# EAGLE design MAC.PHY_shield_boardrouter (EAGLE 6.2)
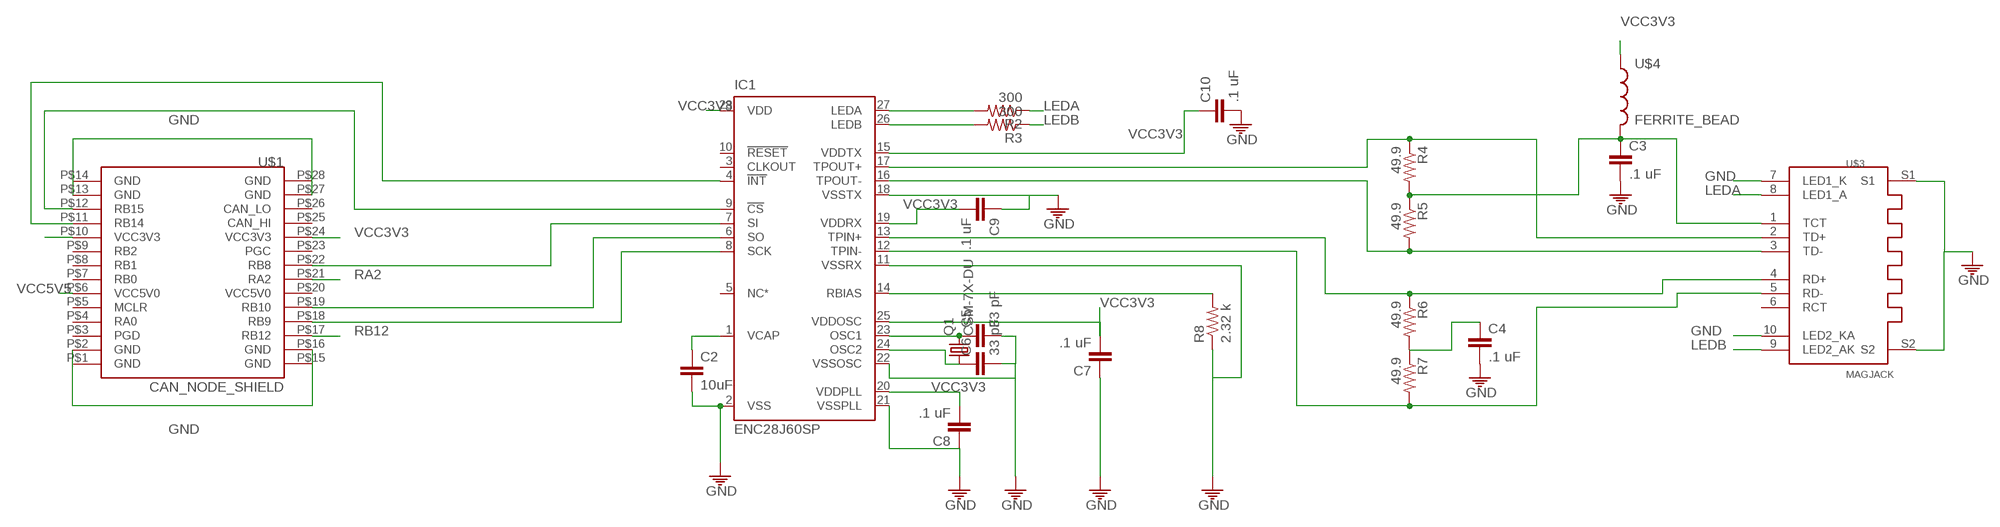
[diagram p0: schematic, sheet 1]

## Parts
C2  10uF  CAP1206  [1206]
C3  .1 uF  CAP1206  [1206]
C4  .1 uF  CAP1206  [1206]
C5  33 pF  CAP1206  [1206]
C6  33 pF  CAP1206  [1206]
C7  .1 uF  CAP1206  [1206]
C8  .1 uF  CAP1206  [1206]
C9  .1 uF  CAP1206  [1206]
C10  .1 uF  CAP1206  [1206]
IC1  ENC28J60SP  [DIL28-3]
Q1  CSM-7X-DU  [CSM-7X-DU]
R2  300  RESISTOR0805-RES  [0805]
R3  300  RESISTOR0805-RES  [0805]
R4  49.9  RESISTOR0805-RES  [0805]
R5  49.9  RESISTOR0805-RES  [0805]
R6  49.9  RESISTOR0805-RES  [0805]
R7  49.9  RESISTOR0805-RES  [0805]
R8  2.32 k  RESISTOR0805-RES  [0805]
U$1  CAN_NODE_SHIELD  [CAN_NODE_SHIELD]
U$3  MAGJACK  [08B0-1X1T-06-F]
U$4  FERRITE_BEAD  [1206]

## Nets
GND: C2.2 C3.2 C4.2 C5.2 C6.2 C7.1 C8.1 C9.1 C10.2 IC1.2(VSS) IC1.11(VSSRX) IC1.18(VSSTX) IC1.21(VSSPLL) IC1.22(VSSOSC) R8.1 U$1.P$1(GND) U$1.P$2(GND) U$1.P$13(GND) U$1.P$14(GND) U$1.P$15(GND) U$1.P$16(GND) U$1.P$27(GND) U$1.P$28(GND) U$3.7(LED1_K) U$3.10(LED2_KA) U$3.S1 U$3.S2
LEDA: R2.1 U$3.8(LED1_A)
LEDB: R3.1 U$3.9(LED2_AK)
N$1: C2.1 IC1.1(VCAP)
N$2: IC1.27(LEDA) R2.2
N$3: IC1.26(LEDB) R3.2
N$4: C3.1 R4.2 R5.1 U$3.1(TCT) U$4.2
N$5: IC1.17(TPOUT+) R4.1 U$3.2(TD+)
N$6: IC1.16(TPOUT-) R5.2 U$3.3(TD-)
N$7: IC1.13(TPIN+) R6.1 U$3.4(RD+)
N$8: C4.1 R6.2 R7.1
N$9: IC1.12(TPIN-) R7.2 U$3.5(RD-)
N$10: IC1.9(!CS) U$1.P$12(RB15)
N$11: IC1.14(RBIAS) R8.2
N$12: IC1.8(SCK) U$1.P$18(RB9)
N$13: C5.1 IC1.23(OSC1) Q1.2
N$14: C6.1 IC1.24(OSC2) Q1.1
N$15: IC1.6(SO) U$1.P$19(RB10)
N$16: IC1.7(SI) U$1.P$22(RB8)
N$17: IC1.4(!INT) U$1.P$11(RB14)
RA2: U$1.P$21(RA2)
RB12: U$1.P$17(RB12)
VCC3V3: C7.2 C8.2 C9.2 C10.1 IC1.15(VDDTX) IC1.19(VDDRX) IC1.20(VDDPLL) IC1.25(VDDOSC) IC1.28(VDD) U$1.P$10(VCC3V3) U$1.P$24(VCC3V3) U$4.1
VCC5V5: U$1.P$6(VCC5V0)
Unconnected: IC1.3(CLKOUT) IC1.5(NC*) IC1.10(!RESET) U$1.P$3(PGD) U$1.P$4(RA0) U$1.P$5(MCLR) U$1.P$7(RB0) U$1.P$8(RB1) U$1.P$9(RB2) U$1.P$20(VCC5V0) U$1.P$23(PGC) U$1.P$25(CAN_HI) U$1.P$26(CAN_LO) U$3.6(RCT)

## Library data of the parts
C2-C10 = ASL:CAP: Capacitor Standard 0603 ceramic capacitor, and 0.1" leaded capacitor.
IC1 = ASL:ENC28J60: Stand-Alone Ethernet Controller with SPI Interface Source: http://ww1.microchip.com/downloads/en/DeviceDoc/39662c.pdf; MF: MICROCHIP; MPN: ENC28J60/SP; OC_FARNELL: 1084619; OC_NEWARK: 96K3661
Q1 = crystal:CSM-7X-DU: SMD CRYSTAL Source: www.ecsxtal.com .. Crystal 3.6864MHz CSM_7X_DU.PDF; OC_FARNELL: unknown; OC_NEWARK: unknown
R2-R8 = ASL:RESISTOR: Resistor Basic schematic elements and footprints for 0603, 1206, and PTH resistors.
U$1 = ASL:CAN_NODE_SHIELD: A shield part for the dsPIC33f CAN node.
U$3 = ASL:MAGJACK
U$4 = ASL:FERRITE_BEAD

## Board
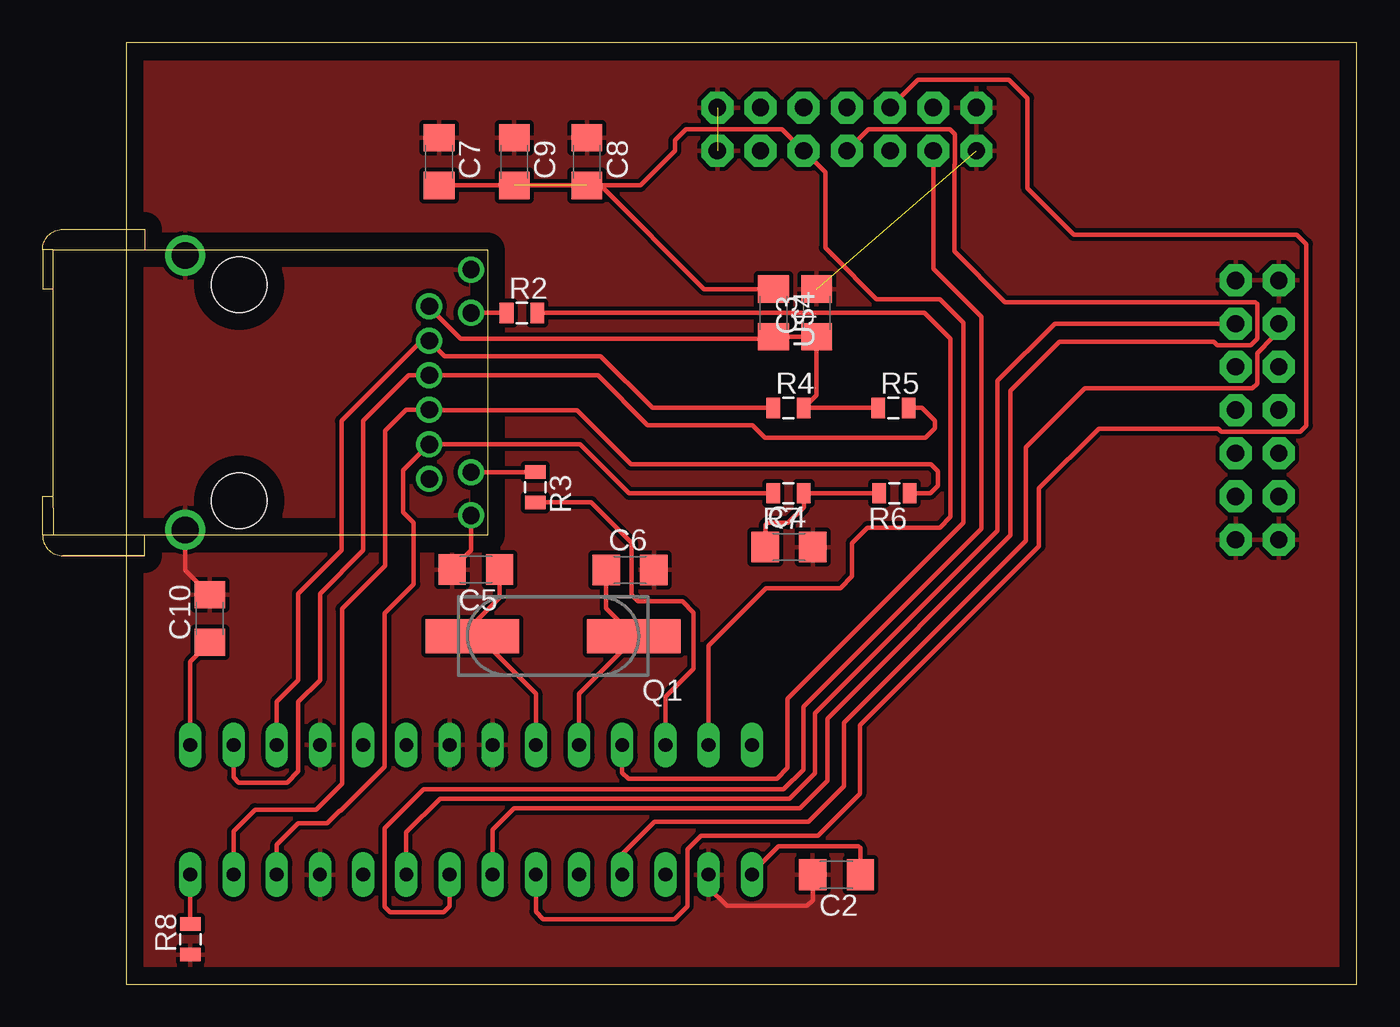
[diagram p1: board, top side]
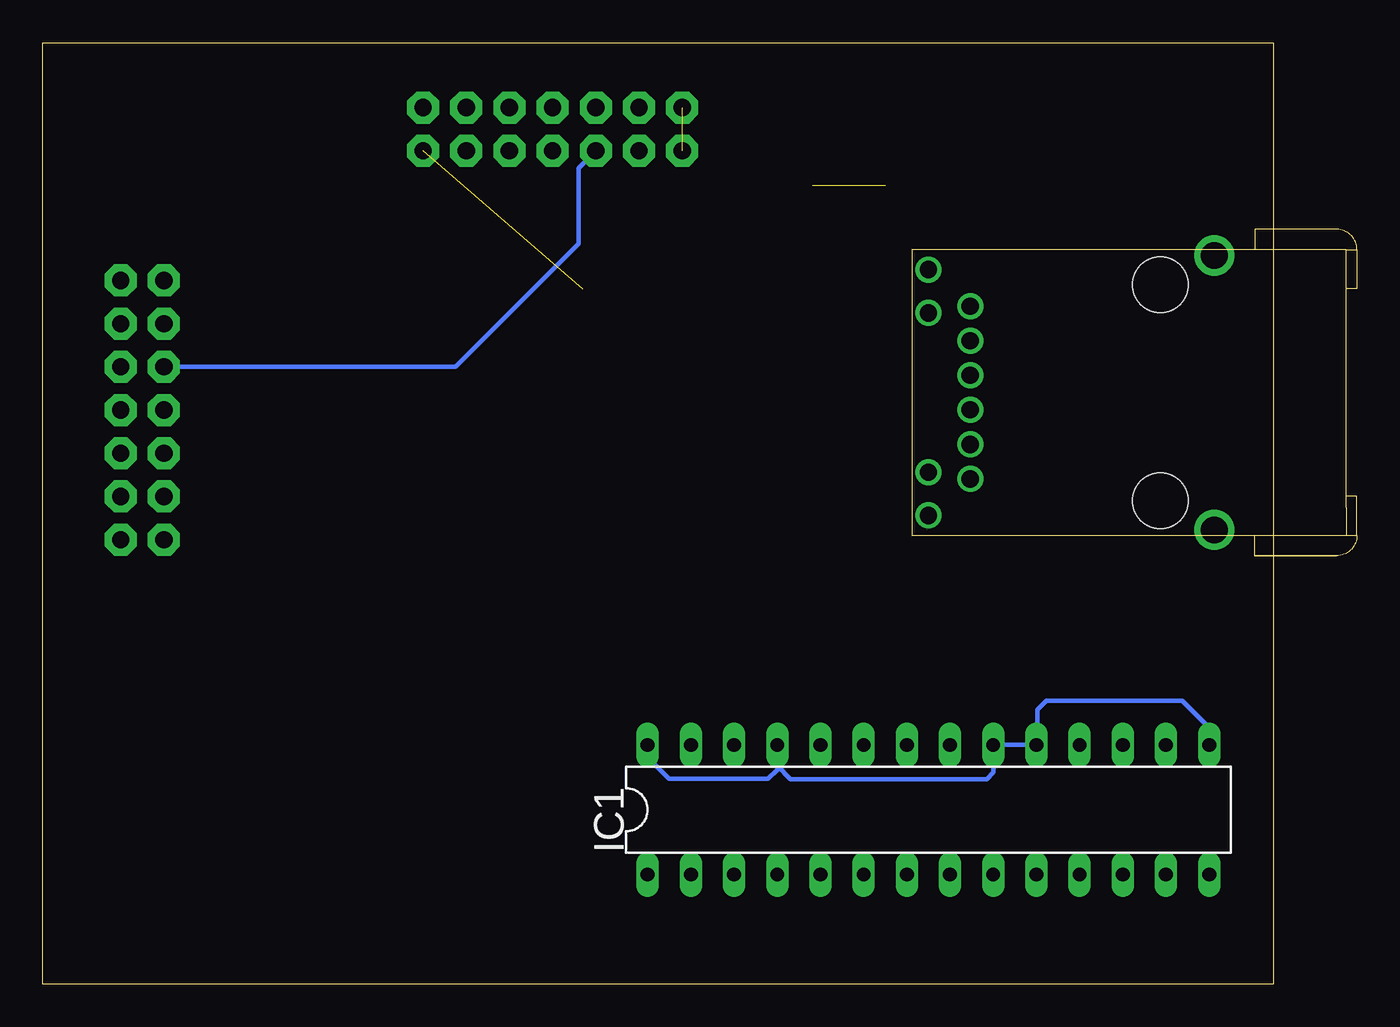
[diagram p2: board, bottom side, seen from below]

Size 72.36 x 55.36 mm. Coordinates in mm from the lower left corner, seen from the top.
Outline: 0,0 72.36,0 72.36,55.34 0,55.36 0,0
Copper layers (1*16): Top 0.035mm / dielectric 1.5mm / Bottom 0.035mm
Design rules: minimum track width 10mil, minimum drill 24mil, track to track 8mil, track to pad 8mil, pad to pad 8mil, via to via 8mil, smd to smd 8mil, copper to edge 40mil, drill to drill 8mil, minimum pad ring 10mil, minimum via ring 8mil, stop-mask expansion 4mil, vias tented up to drill 0mil, thermal gap 10mil

### Footprints (pad centres in the part's own frame; a part is rotated, then mirrored left to right if it is on the bottom)
1206 = smd 1.6 x 1.8: 1 -1.4,0; 2 1.4,0
DIL28-3 = drill 0.813 long: 1 -16.51,-3.81; 2 -13.97,-3.81; 3 -11.43,-3.81; 4 -8.89,-3.81; 5 -6.35,-3.81; 6 -3.81,-3.81; 7 -1.27,-3.81; 8 1.27,-3.81; 9 3.81,-3.81; 10 6.35,-3.81; 11 8.89,-3.81; 12 11.43,-3.81; 13 13.97,-3.81; 14 16.51,-3.81; 15 16.51,3.81; 16 13.97,3.81; 17 11.43,3.81; 18 8.89,3.81; 19 6.35,3.81; 20 3.81,3.81; 21 1.27,3.81; 22 -1.27,3.81; 23 -3.81,3.81; 24 -6.35,3.81; 25 -8.89,3.81; 26 -11.43,3.81; 27 -13.97,3.81; 28 -16.51,3.81
CSM-7X-DU = smd 5.5 x 2: 1 -4.75,0; 2 4.75,0
0805 = smd 0.8 x 1.2: 1 -0.9,0; 2 0.9,0
CAN_NODE_SHIELD = drill 1.016 pad 1.88 octagon: P$1 47.498,8.255; P$2 44.958,8.255; P$3 47.498,10.795; P$4 44.958,10.795; P$5 47.498,13.335; P$6 44.958,13.335; P$7 47.498,15.875; P$8 44.958,15.875; P$9 47.498,18.415; P$10 44.958,18.415; P$11 47.498,20.955; P$12 44.958,20.955; P$13 47.498,23.495; P$14 44.958,23.495; P$15 29.718,33.655; P$16 29.718,31.115; P$17 27.178,33.655; P$18 27.178,31.115; P$19 24.638,33.655; P$20 24.638,31.115; P$21 22.098,33.655; P$22 22.098,31.115; P$23 19.558,33.655; P$24 19.558,31.115; P$25 17.018,33.655; P$26 17.018,31.115; P$27 14.478,33.655; P$28 14.478,31.115
08B0-1X1T-06-F = drill 1.02: 1 2.15,2.46; 2 4.18,2.46; 3 6.21,2.46; 4 8.24,2.46; 5 10.27,2.46; 6 12.3,2.46; 7 0,0; 8 2.54,0; 9 11.91,0; 10 14.45,0 | drill 1.57: S1 -0.83,16.808; S2 15.3,16.809 | hole 3.25: 0.88,13.63; 13.58,13.63

### Placement (x,y rotation side)
C2  41.76,6.44 180 top
C3  40.59,39.47 90 top
C4  38.96,25.71 0 top
C5  20.55,24.38 180 top
C6  29.62,24.36 0 top
C7  18.39,48.36 270 top
C8  27.08,48.36 270 top
C9  22.81,48.36 270 top
C10  4.9,21.5 90 top
IC1  20.27,10.26 0 bottom
Q1  25.1,20.47 180 top
R2  23.25,39.47 0 top
R3  24.05,29.22 270 top
R4  38.94,33.88 0 top
R5  45.1,33.88 0 top
R6  45.16,28.87 180 top
R7  38.94,28.87 180 top
R8  3.76,2.64 90 top
U$1  20.27,17.88 0 top
U$3  20.27,42.01 270 bottom
U$4  38.05,39.47 270 top

### Tracks (layer width: path | path; a pad name or v marks a point on that pad's centre or on a via)
GND  (2 unrouted)
  Top 0.254: IC1.2 34.24,5.69 35.31,4.62 40.03,4.62 40.36,4.95 C2.2 | U$3.S2 3.46,24.34 C10.2 | U$3.10 20.27,25.5 C5.2
  pour Top (isolate 0.254): 71.02,54.58 0.51,54.58 0.51,0.58 71.53,0.58 71.53,54.58
LEDA
  Top 0.254: U$3.8 R2.1
LEDB
  Top 0.254: U$3.9 24.03,30.1 R3.1
N$1
  Top 0.254: IC1.1 36.78,6.55 38.35,8.13 43.05,8.13 43.15,8.03 C2.1
N$2
  Top 0.254: R2.2 46.94,39.47 48.46,37.95 48.46,27.48 47.83,26.85 43.59,26.85 42.67,25.93 42.67,23.98 41.99,23.29 37.62,23.29 34.24,19.91 IC1.27
N$3
  Top 0.254: R3.2 27.33,28.32 29.69,25.96 29.69,22.91 30.1,22.5 32.69,22.5 33.35,21.84 33.35,18.54 31.7,16.89 IC1.26
N$4
  Top 0.254: R5.1 R4.2 40.59,34.63 C3.1 U$4.2 37.92,37.95 19.66,37.95 17.81,39.8 U$3.1
N$5
  Top 0.254: IC1.17 8.84,16.61 10.11,17.88 10.11,22.96 12.65,25.5 12.65,33.12 17.36,37.83 U$3.2 18.71,36.93 27.89,36.93 30.94,33.88 R4.1
N$6
  Top 0.254: R5.2 46.79,33.88 47.55,33.12 47.55,32.69 46.99,32.13 37.54,32.13 36.8,32.87 30.66,32.87 27.74,35.79 17.82,35.79 U$3.3 16.6,35.8 13.92,33.12 13.92,25.5 11.38,22.96 11.38,17.88 10.11,16.61 10.11,12.52 9.45,11.86 6.6,11.86 6.3,12.17 IC1.16
N$7
  Top 0.254: R6.1 47.28,28.87 47.73,29.31 47.73,30.15 47.29,30.58 29.67,30.58 26.49,33.76 17.82,33.76 U$3.4 16.45,33.77 15.21,32.54 15.21,24.61 12.67,22.07 12.67,11.79 11.15,10.26 7.57,10.26 6.3,8.99 IC1.13
N$8
  Top 0.254: R6.2 R7.1 39.84,28.05 38.91,27.13 37.69,27.13 37.57,27 C4.1
N$9
  Top 0.254: R7.2 38.02,28.86 29.57,28.86 26.68,31.74 U$3.5 16.28,30.21 16.28,27.74 16.89,27.13 16.89,23.52 15.19,21.82 15.19,12.8 12.6,10.21 12.55,10.21 11.81,9.47 10.11,9.47 8.84,8.21 IC1.12
N$10
  Top 0.254: IC1.9 16.46,8.94 18.44,10.92 38.99,10.92 40.49,12.42 40.49,15.93 51.23,26.67 51.23,35.48 54.58,38.84 U$1.P$12
N$11
  Top 0.254: IC1.14 R8.2
N$12
  Top 0.254: U$1.P$18 47.45,42.06 50.27,39.24 50.27,26.77 39.8,16.31 39.8,12.62 38.63,11.46 17.48,11.46 15.19,9.17 15.19,4.55 15.49,4.24 18.64,4.24 19,4.6 IC1.8
N$13
  Top 0.254: C5.1 21.95,22.73 20.35,21.13 Q1.2 20.7,20.47 24.08,17.09 IC1.23
N$14
  Top 0.254: C6.1 28.22,22.1 Q1.1 29.85,20.32 26.62,17.09 IC1.24
N$15
  Top 0.254: IC1.6 24.08,4.27 24.51,3.84 32.23,3.84 32.99,4.6 32.99,7.95 33.78,8.74 40.66,8.74 43.13,11.2 43.13,15.21 53.67,25.76 53.67,29.16 57.17,32.66 64.21,32.66 64.39,32.49 69.04,32.49 69.39,32.84 69.39,43.51 68.83,44.07 55.7,44.07 52.98,46.79 52.98,52.1 51.89,53.19 46.56,53.19 U$1.P$19
N$16
  Top 0.254: IC1.7 21.54,9.09 22.78,10.34 39.6,10.34 41.22,11.96 41.22,15.62 51.99,26.39 51.99,34.9 54.86,37.77 63.96,37.77 64.16,37.57 66.12,37.57 66.5,37.95 66.5,40 66.39,40.11 51.66,40.11 48.69,43.08 48.69,48.18 48.72,48.21 48.72,49.96 48.41,50.27 43.64,50.27 U$1.P$22
N$17
  Top 0.254: IC1.4 29.16,7.65 31.06,9.55 40.11,9.55 42.19,11.63 42.19,15.37 52.91,26.09 52.91,31.57 56.36,35.03 66.22,35.03 66.5,35.31 66.5,37.11 67.41,38.02 67.41,38.48 U$1.P$11
VCC3V3  (1 unrouted)
  Top 0.254: IC1.25 29.16,12.45 29.52,12.09 38.25,12.09 38.89,12.73 38.89,16.79 49.23,27.13 49.23,38.89 47.83,40.28 44.12,40.28 41.53,42.88 | 41.53,42.88 41.5,42.88 | IC1.15 3.76,18.96 C10.1 | C7.2 C8.2 27.89,46.96 | 41.53,42.88 41.1,43.31 41.1,47.73 U$1.P$24 38.56,50.27 32.92,50.27 32.26,49.61 32.26,49 30.22,46.96 27.89,46.96 | U$4.1 33.98,40.87 27.89,46.96
  Bottom 0.254: IC1.15 3.76,15.09 5.33,16.66 13.33,16.66 13.87,16.13 13.87,14.12 IC1.19 IC1.20 16.43,14.05 16.43,12.47 16.84,12.06 28.37,12.06 29.16,12.85 IC1.25 29.16,12.62 29.69,12.09 35.51,12.09 36.78,13.36 IC1.28 | U$1.P$10 48.08,36.3 40.84,43.54 40.84,47.98 U$1.P$24